# EAGLE schematic LiPoPiv1.3 (EAGLE 7.6.0)
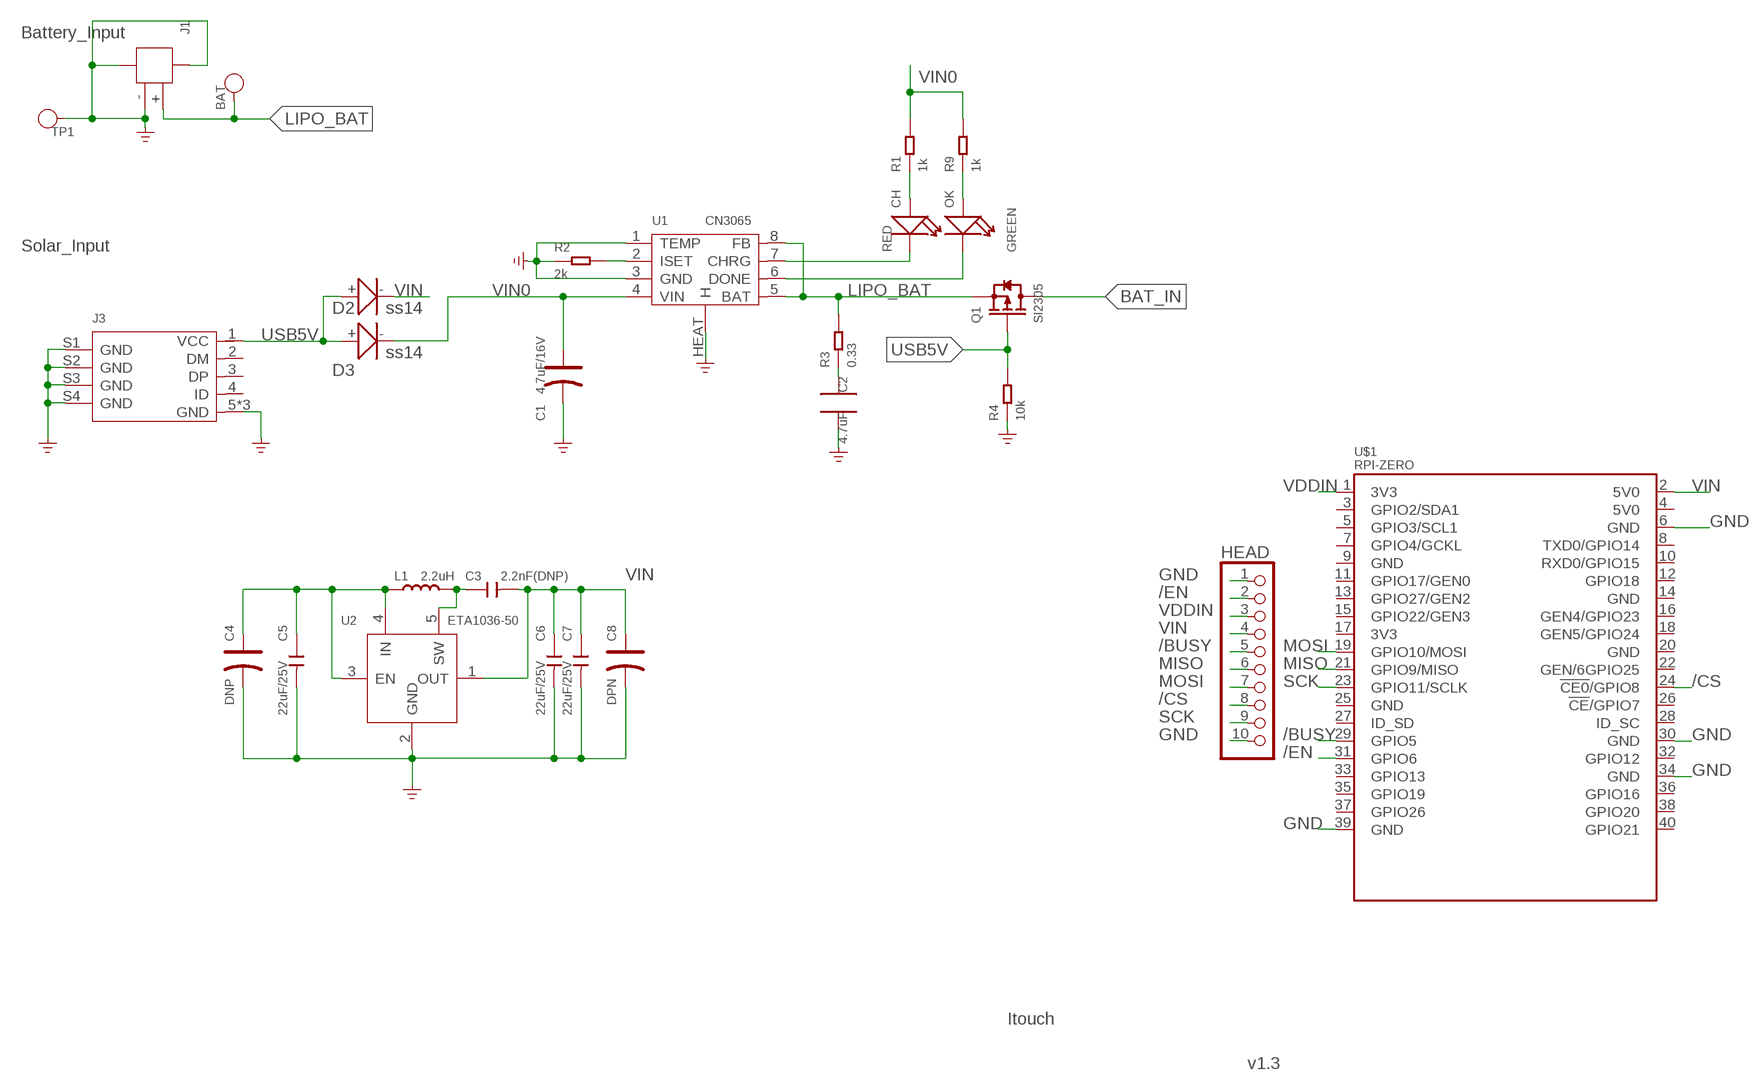
[diagram p0: schematic, sheet 1]

## Parts
BAT  PAD-TEST-POINT'4545'  [TP-D45MIL]
C1  4.7uF/16V  006-CAP_AVX_A  [AVX_A]
C2  4.7uF  C0805  [0805]
C3  2.2nF(DNP)  C-0603  [C0603]
C4  DNP  CAP-AVX-A  [AVX-A]
C5  22uF/25V  CAP-0805  [C0805]
C6  22uF/25V  CAP-0805  [C0805]
C7  22uF/25V  CAP-0805  [C0805]
C8  DPN  CAP-AVX-A  [AVX-A]
CH  RED  LED'0603'  [LED-0603]
D2  ss14  010-D2010  [D2010]
D3  ss14  010-D2010  [D2010]
HEAD  PINHD-1X10  [1X10]
J1  JST-2P-SMD'2.0'  [2P-SMD-2.0-90D]
J3  USB-MICRO-5P'5+4P'  [5+4P-SMD-0.65-B]
L1  2.2uH  INDUCTOR/FERRITE-BEAD'0630'  [L0630]
OK  GREEN  LED'0603'  [LED-0603]
Q1  SI2305  MOSFET-P'SI2323CDS/SI2305DS<BR>'  [SOT-23]
R1  1k  RES-0603  [R0603]
R2  2k  RES-0603  [R0603]
R3  0.33  RES-0603  [R0603]
R4  10k  RES-0603  [R0603]
R9  1k  RES-0603  [R0603]
TP1  PAD-TEST-POINT'4545'  [TP-D45MIL]
U1  CN3065  PMIC-CN3065-DFN8  [DFN-8]
U2  ETA1036-50  ETA1036  [SOT23-5]
U$1  RPI-ZERO  [RASPBERRYPI_BASTELSTUBE_V13_RASPI_BOARD_B+_FULL]

## Nets
/BUSY: HEAD.5 U$1.29(GPIO5)
/CS: HEAD.8 U$1.24(!CE0!/GPIO8)
/EN: HEAD.2 U$1.31(GPIO6)
BAT_IN: C4.+ C5.1 L1.1 Q1.3(D) U2.3(EN) U2.4(IN)
GND: C1.- C2.2 C4.- C5.2 C6.2 C7.2 C8.- HEAD.1 HEAD.10 J1.3 J1.4 J1.- J3.5(GND) J3.S1(GND) J3.S2(GND) J3.S3(GND) J3.S4(GND) J3.S5(GND) J3.S6(GND) R2.1 R4.1 TP1.T U1.1(TEMP) U1.3(GND) U1.HEAT(H) U2.2(GND) U$1.6(GND) U$1.30(GND) U$1.34(GND) U$1.39(GND) ; supply symbol labelled GND_POWER
LIPO_BAT: BAT.T J1.+ Q1.2(S) R3.2 U1.5(BAT) U1.8(FB)
MISO: HEAD.6 U$1.21(GPIO9/MISO)
MOSI: HEAD.7 U$1.19(GPIO10/MOSI)
N$1: C2.1 R3.1
N$2: C3.1 L1.2 U2.5(SW)
N$4: CH.+ R1.1
N$13: R2.2 U1.2(ISET)
N$14: CH.- U1.7(CHRG)
N$15: OK.- U1.6(DONE)
N$16: OK.+ R9.1
SCK: HEAD.9 U$1.23(GPIO11/SCLK)
USB5V: D2.+ D3.+ J3.1(VCC) Q1.1(G) R4.2
VDDIN: HEAD.3 U$1.1(3V3)
VIN: C3.2 C6.1 C7.1 C8.+ D2.- HEAD.4 U2.1(OUT) U$1.2(5V0)
VIN0: C1.+ D3.- R1.2 R9.2 U1.4(VIN)
Unconnected: J3.2(DM) J3.3(DP) J3.4(ID) U$1.3(GPIO2/SDA1) U$1.4(5V0) U$1.5(GPIO3/SCL1) U$1.7(GPIO4/GCKL) U$1.8(TXD0/GPIO14) U$1.9(GND) U$1.10(RXD0/GPIO15) U$1.11(GPIO17/GEN0) U$1.12(GPIO18) U$1.13(GPIO27/GEN2) U$1.14(GND) U$1.15(GPIO22/GEN3) U$1.16(GEN4/GPIO23) U$1.17(3V3) U$1.18(GEN5/GPIO24) U$1.20(GND) U$1.22(GEN/6GPIO25) U$1.25(GND) U$1.26(!CE!/GPIO7) U$1.27(ID_SD) U$1.28(ID_SC) U$1.32(GPIO12) U$1.33(GPIO13) U$1.35(GPIO19) U$1.36(GPIO16) U$1.37(GPIO26) U$1.38(GPIO20) U$1.40(GPIO21)

## Notes on the sheet
- Battery_Input
- Solar_Input
- Itouch
- v1.3

## Library data of the parts
BAT TP1 = Discrete-new:PAD-TEST-POINT; PARTNO: DNP
C1 = Discrete:006-CAP*: Electrolytic Capacitors,Tantalum Capacitors and Super Capacitors
C2 = CPT_SMD:C0805
C3 = Discrete:C*: Ceramic Capacitors
C4 C8 = Discrete:CAP*: Electrolytic Capacitors,Tantalum Capacitors and Super Capacitors
C5-C7 = Discrete-new:CAP: Ceramic Capacitors
CH OK = Discrete-new:LED
D2 D3 = Discrete:010-D*
HEAD = pinhead:PINHD-1X10: PIN HEADER
J1 = Connector-new:JST-2P-SMD: 2P-SMD-1.0-90D:320110054;2P-SMD-2.0-90D:320110026
J3 = Connector-new:USB-MICRO-5P: 5+4P-SMD-0.65-B:320010000;5+2P-SMD-0.65-AB:340032001
L1 = Discrete-new:INDUCTOR/FERRITE-BEAD
Q1 = Discrete-new:MOSFET-P
R1-R4 R9 = Discrete-new:RES
U1 = IC-new:PMIC-CN3065: 310030101
U2 = IC:ETA1036
U$1 = RPI-Zero:RPI-ZERO

## Net classes
0 default: width 0.203 mm, drill 0.305 mm, clearance 0.127 mm